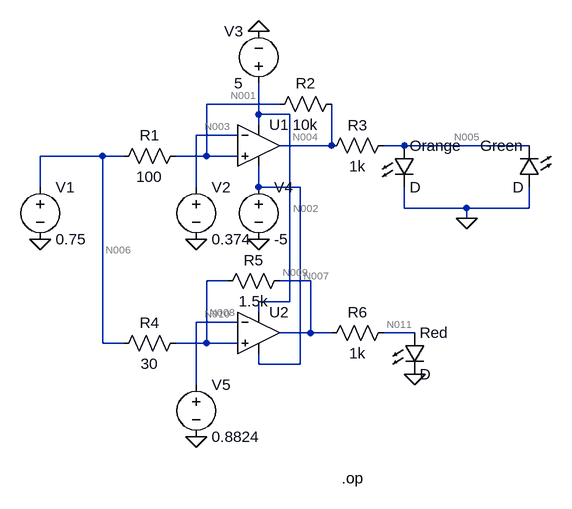
[diagram p0: schematic Temperature Indicator.asc]
Temperature Indicator.asc, the LTspice schematic file:
Version 4
SHEET 1 880 680
WIRE 128 32 16 32
WIRE 96 48 96 0
WIRE 144 48 96 48
WIRE 96 64 96 48
WIRE 64 80 0 80
WIRE 208 96 208 32
WIRE 208 96 128 96
WIRE 320 96 288 96
WIRE 512 96 320 96
WIRE -144 112 -240 112
WIRE -112 112 -144 112
WIRE 16 112 16 32
WIRE 16 112 -32 112
WIRE 64 112 16 112
WIRE -240 160 -240 112
WIRE 0 160 0 80
WIRE 96 160 96 128
WIRE 160 160 96 160
WIRE 320 192 320 160
WIRE 416 192 320 192
WIRE 512 192 512 160
WIRE 512 192 416 192
WIRE 416 208 416 192
WIRE 48 304 16 304
WIRE 176 304 128 304
WIRE 144 336 144 48
WIRE 144 336 96 336
WIRE 96 352 96 336
WIRE 64 368 0 368
WIRE 176 384 176 304
WIRE 176 384 128 384
WIRE 208 384 176 384
WIRE 336 384 288 384
WIRE -144 400 -144 112
WIRE -112 400 -144 400
WIRE 16 400 16 304
WIRE 16 400 -32 400
WIRE 64 400 16 400
WIRE 96 432 96 416
WIRE 160 432 160 160
WIRE 160 432 96 432
WIRE 0 464 0 368
FLAG 0 240 0
FLAG -240 240 0
FLAG 96 -80 0
FLAG 96 240 0
FLAG 416 208 0
FLAG 0 544 0
FLAG 336 448 0
SYMBOL OpAmps\\UniversalOpAmp 96 96 R0
SYMATTR InstName U1
SYMBOL voltage -240 144 R0
WINDOW 123 0 0 Left 0
WINDOW 39 0 0 Left 0
SYMATTR InstName V1
SYMATTR Value 0.75
SYMBOL res -16 96 R90
WINDOW 0 0 56 VBottom 2
WINDOW 3 32 56 VTop 2
SYMATTR InstName R1
SYMATTR Value 100
SYMBOL voltage 0 144 R0
WINDOW 123 0 0 Left 0
WINDOW 39 0 0 Left 0
SYMATTR InstName V2
SYMATTR Value 0.374
SYMBOL voltage 96 16 R180
WINDOW 0 24 96 Left 2
WINDOW 3 24 16 Left 2
WINDOW 123 0 0 Left 0
WINDOW 39 0 0 Left 0
SYMATTR InstName V3
SYMATTR Value 5
SYMBOL voltage 96 144 R0
WINDOW 123 0 0 Left 0
WINDOW 39 0 0 Left 0
SYMATTR InstName V4
SYMATTR Value -5
SYMBOL res 224 16 R90
WINDOW 0 0 56 VBottom 2
WINDOW 3 32 56 VTop 2
SYMATTR InstName R2
SYMATTR Value 10k
SYMBOL res 304 80 R90
WINDOW 0 0 56 VBottom 2
WINDOW 3 32 56 VTop 2
SYMATTR InstName R3
SYMATTR Value 1k
SYMBOL LED 304 96 R0
SYMATTR InstName Orange
SYMBOL LED 528 160 R180
WINDOW 0 24 64 Left 2
WINDOW 3 24 0 Left 2
SYMATTR InstName Green
SYMBOL res -16 384 R90
WINDOW 0 0 56 VBottom 2
WINDOW 3 32 56 VTop 2
SYMATTR InstName R4
SYMATTR Value 30
SYMBOL OpAmps\\UniversalOpAmp 96 384 R0
SYMATTR InstName U2
SYMBOL res 144 288 R90
WINDOW 0 0 56 VBottom 2
WINDOW 3 32 56 VTop 2
SYMATTR InstName R5
SYMATTR Value 1.5k
SYMBOL voltage 0 448 R0
WINDOW 123 0 0 Left 0
WINDOW 39 0 0 Left 0
SYMATTR InstName V5
SYMATTR Value 0.8824
SYMBOL res 304 368 R90
WINDOW 0 0 56 VBottom 2
WINDOW 3 32 56 VTop 2
SYMATTR InstName R6
SYMATTR Value 1k
SYMBOL LED 320 384 R0
SYMATTR InstName Red
TEXT 224 608 Left 2 !.op

The netlist it stands for:
* Temperature Indicator.asc
XU1 N001 N003 N002 N007 N004 level1 Avol=1Meg GBW=10Meg Vos=0 En=0 Enk=0 In=0 Ink=0 Rin=500Meg  ; pins In+ In- V+ V- OUT
V1 N006 0 0.75
R1 N001 N006 100
V2 N003 0 0.374
V3 N002 0 5
V4 N007 0 -5
R2 N004 N001 10k
R3 N005 N004 1k
D§Orange N005 0 D
D§Green 0 N005 D
R4 N008 N006 30
XU2 N008 N010 N002 N007 N009 level1 Avol=1Meg GBW=10Meg Vos=0 En=0 Enk=0 In=0 Ink=0 Rin=500Meg  ; pins In+ In- V+ V- OUT
R5 N009 N008 1.5k
V5 N010 0 0.8824
R6 N011 N009 1k
D§Red N011 0 D
.model D D
.lib standard.dio
.op
.lib UniversalOpAmp1.lib
.backanno
.end

* Results of the author's LTspice run, read from the files saved beside the schematic
* Operating Point:
*   V(n003) = 374 mV
*   V(n001) = 374 mV
*   V(n004) = -37.23 V
*   V(n002) = 5 V
*   V(n007) = -5 V
*   V(n006) = 750 mV
*   V(n005) = -748.2 mV
*   V(n008) = 882.4 mV
*   V(n010) = 882.4 mV
*   V(n009) = 7.503 V
*   V(n011) = 704.7 mV
*   I(Orange) = -758.2 fA
*   I(Green) = 36.48 mA
*   I(Red) = 6.798 mA
*   I(R1) = -3.76 mA
*   I(R2) = -3.76 mA
*   I(R3) = 36.48 mA
*   I(R4) = 4.414 mA
*   I(R5) = 4.414 mA
*   I(R6) = -6.798 mA
*   I(V1) = 653.2 µA
*   I(V2) = -748 pA
*   I(V3) = -17.49 nA
*   I(V4) = 22.51 nA
*   I(V5) = -1.765 nA
*   Ix(u1:1) = 747.9 pA
*   Ix(u1:2) = 748 pA
*   Ix(u1:3) = 9.252 nA
*   Ix(u1:4) = -10.75 nA
*   Ix(u1:5) = 40.24 mA
*   Ix(u2:1) = 1.765 nA
*   Ix(u2:2) = 1.765 nA
*   Ix(u2:3) = 8.235 nA
*   Ix(u2:4) = -11.76 nA
*   Ix(u2:5) = -11.21 mA
* From the log:
*   Semiconductor Device Operating Points:
*                           --- Diodes ---
*   Name:   d§orange     d§green      d§red
*   Model:      d           d           d
*   Id:     -7.58e-13    3.65e-02    6.80e-03
*   Vd:     -7.48e-01    7.48e-01    7.05e-01
*   Req:     1.00e+12    7.09e-01    3.80e+00
*   CAP:     0.00e+00    0.00e+00    0.00e+00